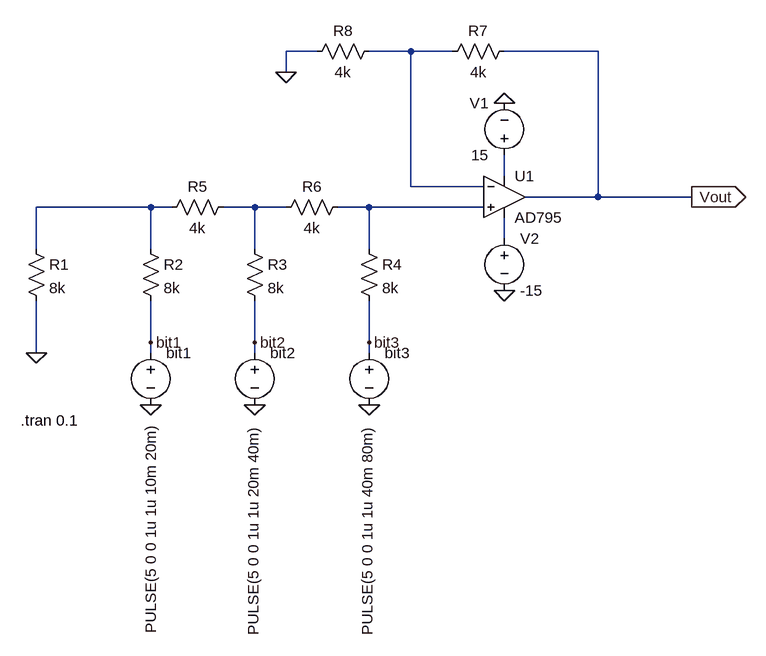
[diagram p0: schematic Draft.asc]
Draft.asc, the LTspice schematic file:
Version 4
SHEET 1 880 872
WIRE -16 -48 -64 -48
WIRE 128 -48 64 -48
WIRE 192 -48 128 -48
WIRE 416 -48 272 -48
WIRE -64 -16 -64 -48
WIRE 272 144 272 112
WIRE 128 160 128 -48
WIRE 240 160 128 160
WIRE 416 176 416 -48
WIRE 416 176 304 176
WIRE 560 176 416 176
WIRE -272 192 -448 192
WIRE -240 192 -272 192
WIRE -112 192 -160 192
WIRE -64 192 -112 192
WIRE 64 192 16 192
WIRE 240 192 64 192
WIRE 272 240 272 208
WIRE -448 256 -448 192
WIRE -272 256 -272 192
WIRE -112 256 -112 192
WIRE 64 256 64 192
WIRE -272 400 -272 336
WIRE -112 400 -112 336
WIRE 64 400 64 336
WIRE -448 416 -448 336
WIRE -272 416 -272 400
WIRE -112 416 -112 400
WIRE 64 416 64 400
FLAG -64 -16 0
FLAG -448 416 0
FLAG 272 32 0
FLAG 272 320 0
FLAG -272 496 0
FLAG -112 496 0
FLAG 64 496 0
FLAG 560 176 Vout
IOPIN 560 176 Out
FLAG -272 400 bit1
FLAG -112 400 bit2
FLAG 64 400 bit3
SYMBOL OpAmps\\AD795 272 112 R0
SYMATTR InstName U1
SYMBOL res -464 240 R0
SYMATTR InstName R1
SYMATTR Value 8k
SYMBOL res -288 240 R0
SYMATTR InstName R2
SYMATTR Value 8k
SYMBOL res -128 240 R0
SYMATTR InstName R3
SYMATTR Value 8k
SYMBOL res 48 240 R0
SYMATTR InstName R4
SYMATTR Value 8k
SYMBOL res -144 176 R90
WINDOW 0 0 56 VBottom 2
WINDOW 3 32 56 VTop 2
SYMATTR InstName R5
SYMATTR Value 4k
SYMBOL res 32 176 R90
WINDOW 0 0 56 VBottom 2
WINDOW 3 32 56 VTop 2
SYMATTR InstName R6
SYMATTR Value 4k
SYMBOL res 80 -64 R90
WINDOW 0 0 56 VBottom 2
WINDOW 3 32 56 VTop 2
SYMATTR InstName R8
SYMATTR Value 4k
SYMBOL res 288 -64 R90
WINDOW 0 0 56 VBottom 2
WINDOW 3 32 56 VTop 2
SYMATTR InstName R7
SYMATTR Value 4k
SYMBOL voltage 64 400 R0
WINDOW 123 0 0 Left 0
WINDOW 39 0 0 Left 0
WINDOW 3 -3 127 VRight 2
SYMATTR InstName bit3
SYMATTR Value PULSE(5 0 0 1u 1u 40m 80m)
SYMBOL voltage -112 400 R0
WINDOW 123 0 0 Left 0
WINDOW 39 0 0 Left 0
WINDOW 3 -2 127 VRight 2
SYMATTR InstName bit2
SYMATTR Value PULSE(5 0 0 1u 1u 20m 40m)
SYMBOL voltage -272 400 R0
WINDOW 123 0 0 Left 0
WINDOW 39 0 0 Left 0
WINDOW 3 0 124 VRight 2
SYMATTR InstName bit1
SYMATTR Value PULSE(5 0 0 1u 1u 10m 20m)
SYMBOL voltage 272 224 R0
WINDOW 123 0 0 Left 0
WINDOW 39 0 0 Left 0
SYMATTR InstName V2
SYMATTR Value -15
SYMBOL voltage 272 128 R180
WINDOW 0 24 96 Left 2
WINDOW 3 24 16 Left 2
WINDOW 123 0 0 Left 0
WINDOW 39 0 0 Left 0
SYMATTR InstName V1
SYMATTR Value 15
TEXT -472 520 Left 2 !.tran 0.1

The netlist it stands for:
* Draft.asc
XU1 N005 N001 N002 N006 Vout AD795  ; pins In+ In- V+ V- OUT
R1 N003 0 8k
R2 N003 bit1 8k
R3 N004 bit2 8k
R4 N005 bit3 8k
R5 N004 N003 4k
R6 N005 N004 4k
R8 N001 0 4k
R7 Vout N001 4k
V§bit3 bit3 0 PULSE(5 0 0 1u 1u 40m 80m)
V§bit2 bit2 0 PULSE(5 0 0 1u 1u 20m 40m)
V§bit1 bit1 0 PULSE(5 0 0 1u 1u 10m 20m)
V2 N006 0 -15
V1 N002 0 15
.tran 0.1
.lib ADI1.lib
.backanno
.end